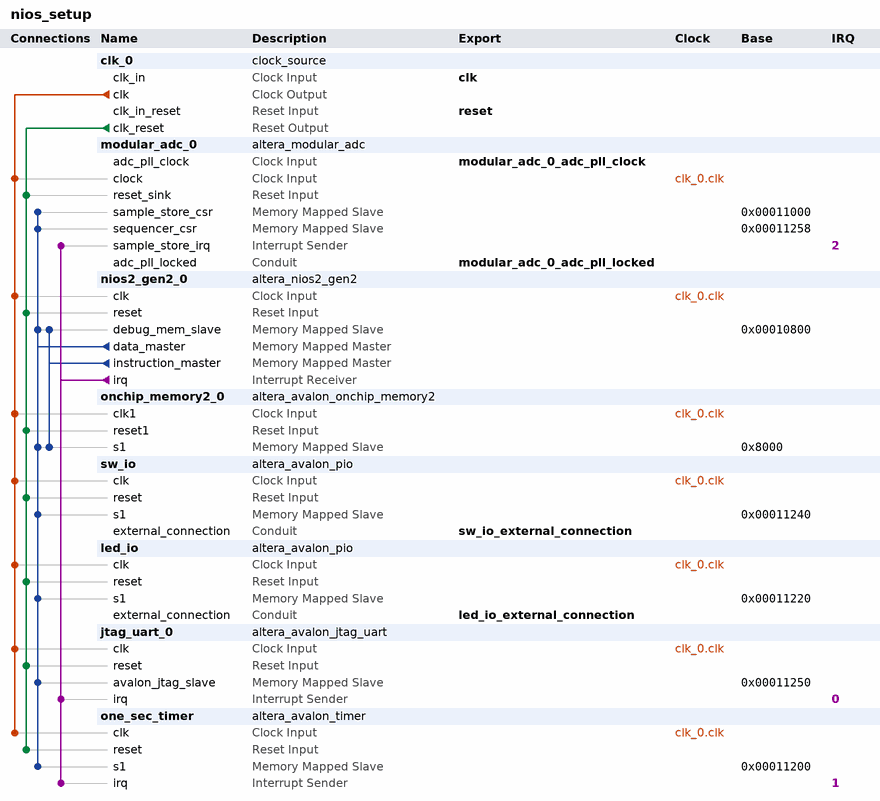
[diagram p0: system contents]
# Platform Designer (Qsys) system nios_setup, MAX 10 10M08DAF484C8GES
# Parameters at their usual value, and those the tool derives, are not listed.
package require -exact qsys 14.1
create_system nios_setup
set_project_property DEVICE_FAMILY {MAX 10}
set_project_property DEVICE 10M08DAF484C8GES

add_instance clk_0 clock_source 14.1
set_instance_parameter_value clk_0 clockFrequency 50000000

add_instance modular_adc_0 altera_modular_adc 14.1
set_instance_parameter_value modular_adc_0 CLOCK_FREQ 50000000
set_instance_parameter_value modular_adc_0 CORE_VAR 0
set_instance_parameter_value modular_adc_0 DEVICE_PART 10M08DAF484C8GES
set_instance_parameter_value modular_adc_0 clkdiv 2
set_instance_parameter_value modular_adc_0 int_vref_vr 3.0
set_instance_parameter_value modular_adc_0 refsel 1
set_instance_parameter_value modular_adc_0 seq_order_length 64
set_instance_parameter_value modular_adc_0 seq_order_slot_1 17
set_instance_parameter_value modular_adc_0 seq_order_slot_10 17
set_instance_parameter_value modular_adc_0 seq_order_slot_11 17
set_instance_parameter_value modular_adc_0 seq_order_slot_12 17
set_instance_parameter_value modular_adc_0 seq_order_slot_13 17
set_instance_parameter_value modular_adc_0 seq_order_slot_14 17
set_instance_parameter_value modular_adc_0 seq_order_slot_15 17
set_instance_parameter_value modular_adc_0 seq_order_slot_16 17
set_instance_parameter_value modular_adc_0 seq_order_slot_17 17
set_instance_parameter_value modular_adc_0 seq_order_slot_18 17
set_instance_parameter_value modular_adc_0 seq_order_slot_19 17
set_instance_parameter_value modular_adc_0 seq_order_slot_2 17
set_instance_parameter_value modular_adc_0 seq_order_slot_20 17
set_instance_parameter_value modular_adc_0 seq_order_slot_21 17
set_instance_parameter_value modular_adc_0 seq_order_slot_22 17
set_instance_parameter_value modular_adc_0 seq_order_slot_23 17
set_instance_parameter_value modular_adc_0 seq_order_slot_24 17
set_instance_parameter_value modular_adc_0 seq_order_slot_25 17
set_instance_parameter_value modular_adc_0 seq_order_slot_26 17
set_instance_parameter_value modular_adc_0 seq_order_slot_27 17
set_instance_parameter_value modular_adc_0 seq_order_slot_28 17
set_instance_parameter_value modular_adc_0 seq_order_slot_29 17
set_instance_parameter_value modular_adc_0 seq_order_slot_3 17
set_instance_parameter_value modular_adc_0 seq_order_slot_30 17
set_instance_parameter_value modular_adc_0 seq_order_slot_31 17
set_instance_parameter_value modular_adc_0 seq_order_slot_32 17
set_instance_parameter_value modular_adc_0 seq_order_slot_33 17
set_instance_parameter_value modular_adc_0 seq_order_slot_34 17
set_instance_parameter_value modular_adc_0 seq_order_slot_35 17
set_instance_parameter_value modular_adc_0 seq_order_slot_36 17
set_instance_parameter_value modular_adc_0 seq_order_slot_37 17
set_instance_parameter_value modular_adc_0 seq_order_slot_38 17
set_instance_parameter_value modular_adc_0 seq_order_slot_39 17
set_instance_parameter_value modular_adc_0 seq_order_slot_4 17
set_instance_parameter_value modular_adc_0 seq_order_slot_40 17
set_instance_parameter_value modular_adc_0 seq_order_slot_41 17
set_instance_parameter_value modular_adc_0 seq_order_slot_42 17
set_instance_parameter_value modular_adc_0 seq_order_slot_43 17
set_instance_parameter_value modular_adc_0 seq_order_slot_44 17
set_instance_parameter_value modular_adc_0 seq_order_slot_45 17
set_instance_parameter_value modular_adc_0 seq_order_slot_46 17
set_instance_parameter_value modular_adc_0 seq_order_slot_47 17
set_instance_parameter_value modular_adc_0 seq_order_slot_48 17
set_instance_parameter_value modular_adc_0 seq_order_slot_49 17
set_instance_parameter_value modular_adc_0 seq_order_slot_5 17
set_instance_parameter_value modular_adc_0 seq_order_slot_50 17
set_instance_parameter_value modular_adc_0 seq_order_slot_51 17
set_instance_parameter_value modular_adc_0 seq_order_slot_52 17
set_instance_parameter_value modular_adc_0 seq_order_slot_53 17
set_instance_parameter_value modular_adc_0 seq_order_slot_54 17
set_instance_parameter_value modular_adc_0 seq_order_slot_55 17
set_instance_parameter_value modular_adc_0 seq_order_slot_56 17
set_instance_parameter_value modular_adc_0 seq_order_slot_57 17
set_instance_parameter_value modular_adc_0 seq_order_slot_58 17
set_instance_parameter_value modular_adc_0 seq_order_slot_59 17
set_instance_parameter_value modular_adc_0 seq_order_slot_6 17
set_instance_parameter_value modular_adc_0 seq_order_slot_60 17
set_instance_parameter_value modular_adc_0 seq_order_slot_61 17
set_instance_parameter_value modular_adc_0 seq_order_slot_62 17
set_instance_parameter_value modular_adc_0 seq_order_slot_63 17
set_instance_parameter_value modular_adc_0 seq_order_slot_64 17
set_instance_parameter_value modular_adc_0 seq_order_slot_7 17
set_instance_parameter_value modular_adc_0 seq_order_slot_8 17
set_instance_parameter_value modular_adc_0 seq_order_slot_9 17
set_instance_parameter_value modular_adc_0 tsclkdiv 1
set_instance_parameter_value modular_adc_0 use_ch0 false
set_instance_parameter_value modular_adc_0 use_ch1 false
set_instance_parameter_value modular_adc_0 use_ch2 false
set_instance_parameter_value modular_adc_0 use_ch3 false
set_instance_parameter_value modular_adc_0 use_ch4 false
set_instance_parameter_value modular_adc_0 use_ch5 false
set_instance_parameter_value modular_adc_0 use_ch6 false
set_instance_parameter_value modular_adc_0 use_ch7 false
set_instance_parameter_value modular_adc_0 use_ch8 false
set_instance_parameter_value modular_adc_0 use_tsd true

add_instance nios2_gen2_0 altera_nios2_gen2 14.1
set_instance_parameter_value nios2_gen2_0 dcache_size 2048
set_instance_parameter_value nios2_gen2_0 exceptionSlave onchip_memory2_0.s1
set_instance_parameter_value nios2_gen2_0 icache_size 4096
set_instance_parameter_value nios2_gen2_0 impl Tiny
set_instance_parameter_value nios2_gen2_0 resetSlave onchip_memory2_0.s1

add_instance onchip_memory2_0 altera_avalon_onchip_memory2 14.1
set_instance_parameter_value onchip_memory2_0 dataWidth 32
set_instance_parameter_value onchip_memory2_0 dualPort false
set_instance_parameter_value onchip_memory2_0 initMemContent true
set_instance_parameter_value onchip_memory2_0 initializationFileName /data/acastill/beMicro_v1/software/temp_sensor/mem_init/master_imageondie_temp.hex
set_instance_parameter_value onchip_memory2_0 memorySize 32768

add_instance sw_io altera_avalon_pio 14.1
set_instance_parameter_value sw_io captureEdge true
set_instance_parameter_value sw_io direction Input
set_instance_parameter_value sw_io width 3

add_instance led_io altera_avalon_pio 14.1
set_instance_parameter_value led_io bitModifyingOutReg true
set_instance_parameter_value led_io direction Output
set_instance_parameter_value led_io width 3

add_instance jtag_uart_0 altera_avalon_jtag_uart 14.1
set_instance_parameter_value jtag_uart_0 simInteractiveOptions NO_INTERACTIVE_WINDOWS

add_instance one_sec_timer altera_avalon_timer 14.1
set_instance_parameter_value one_sec_timer period 1
set_instance_parameter_value one_sec_timer periodUnits SEC

# connections
add_connection clk_0.clk jtag_uart_0.clk clock
add_connection clk_0.clk led_io.clk clock
add_connection clk_0.clk modular_adc_0.clock clock
add_connection clk_0.clk nios2_gen2_0.clk clock
add_connection clk_0.clk onchip_memory2_0.clk1 clock
add_connection clk_0.clk one_sec_timer.clk clock
add_connection clk_0.clk sw_io.clk clock
add_connection clk_0.clk_reset jtag_uart_0.reset reset
add_connection clk_0.clk_reset led_io.reset reset
add_connection clk_0.clk_reset modular_adc_0.reset_sink reset
add_connection clk_0.clk_reset nios2_gen2_0.reset reset
add_connection clk_0.clk_reset onchip_memory2_0.reset1 reset
add_connection clk_0.clk_reset one_sec_timer.reset reset
add_connection clk_0.clk_reset sw_io.reset reset
add_connection nios2_gen2_0.data_master jtag_uart_0.avalon_jtag_slave avalon
set_connection_parameter_value nios2_gen2_0.data_master/jtag_uart_0.avalon_jtag_slave baseAddress 0x00011250
add_connection nios2_gen2_0.data_master led_io.s1 avalon
set_connection_parameter_value nios2_gen2_0.data_master/led_io.s1 baseAddress 0x00011220
add_connection nios2_gen2_0.data_master modular_adc_0.sample_store_csr avalon
set_connection_parameter_value nios2_gen2_0.data_master/modular_adc_0.sample_store_csr baseAddress 0x00011000
add_connection nios2_gen2_0.data_master modular_adc_0.sequencer_csr avalon
set_connection_parameter_value nios2_gen2_0.data_master/modular_adc_0.sequencer_csr baseAddress 0x00011258
add_connection nios2_gen2_0.data_master nios2_gen2_0.debug_mem_slave avalon
set_connection_parameter_value nios2_gen2_0.data_master/nios2_gen2_0.debug_mem_slave baseAddress 0x00010800
add_connection nios2_gen2_0.data_master onchip_memory2_0.s1 avalon
set_connection_parameter_value nios2_gen2_0.data_master/onchip_memory2_0.s1 baseAddress 0x8000
add_connection nios2_gen2_0.data_master one_sec_timer.s1 avalon
set_connection_parameter_value nios2_gen2_0.data_master/one_sec_timer.s1 baseAddress 0x00011200
add_connection nios2_gen2_0.data_master sw_io.s1 avalon
set_connection_parameter_value nios2_gen2_0.data_master/sw_io.s1 baseAddress 0x00011240
add_connection nios2_gen2_0.instruction_master nios2_gen2_0.debug_mem_slave avalon
set_connection_parameter_value nios2_gen2_0.instruction_master/nios2_gen2_0.debug_mem_slave baseAddress 0x00010800
add_connection nios2_gen2_0.instruction_master onchip_memory2_0.s1 avalon
set_connection_parameter_value nios2_gen2_0.instruction_master/onchip_memory2_0.s1 baseAddress 0x8000
add_connection nios2_gen2_0.irq jtag_uart_0.irq interrupt
set_connection_parameter_value nios2_gen2_0.irq/jtag_uart_0.irq irqNumber 0
add_connection nios2_gen2_0.irq modular_adc_0.sample_store_irq interrupt
set_connection_parameter_value nios2_gen2_0.irq/modular_adc_0.sample_store_irq irqNumber 2
add_connection nios2_gen2_0.irq one_sec_timer.irq interrupt
set_connection_parameter_value nios2_gen2_0.irq/one_sec_timer.irq irqNumber 1

# exported interfaces
add_interface clk clock sink
set_interface_property clk EXPORT_OF clk_0.clk_in
add_interface led_io_external_connection conduit end
set_interface_property led_io_external_connection EXPORT_OF led_io.external_connection
add_interface modular_adc_0_adc_pll_clock clock sink
set_interface_property modular_adc_0_adc_pll_clock EXPORT_OF modular_adc_0.adc_pll_clock
add_interface modular_adc_0_adc_pll_locked conduit end
set_interface_property modular_adc_0_adc_pll_locked EXPORT_OF modular_adc_0.adc_pll_locked
add_interface reset reset sink
set_interface_property reset EXPORT_OF clk_0.clk_in_reset
add_interface sw_io_external_connection conduit end
set_interface_property sw_io_external_connection EXPORT_OF sw_io.external_connection

set_interconnect_requirement {$system} qsys_mm.clockCrossingAdapter HANDSHAKE
set_interconnect_requirement {$system} qsys_mm.insertDefaultSlave FALSE
set_interconnect_requirement {$system} qsys_mm.maxAdditionalLatency 1

save_system nios_setup.qsys
